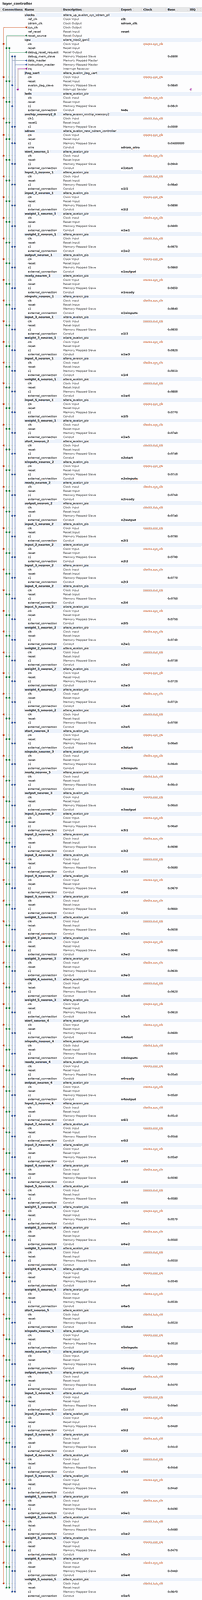
[diagram p0: system contents, whole]
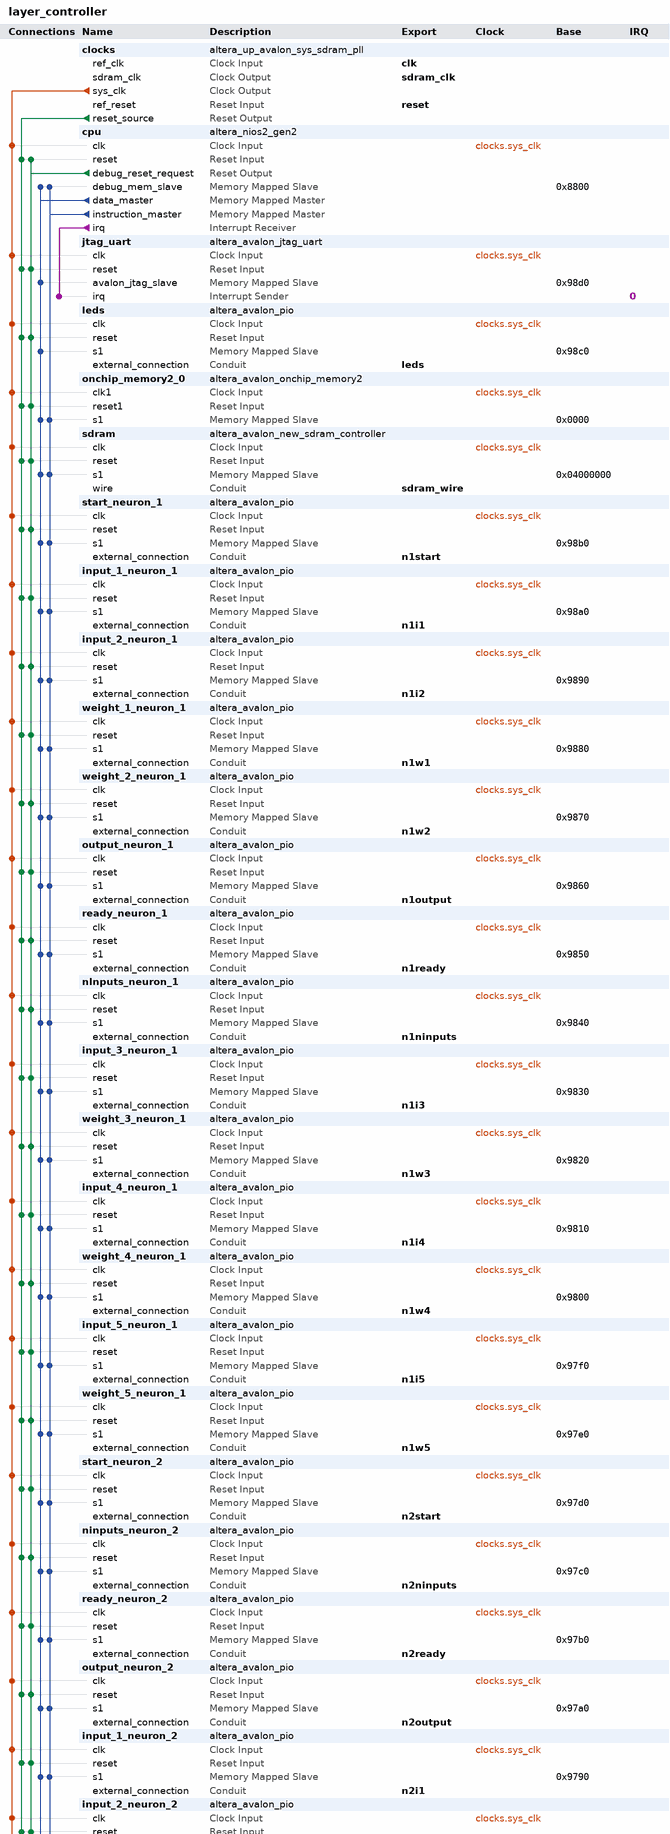
[diagram p1: system contents, upper part]
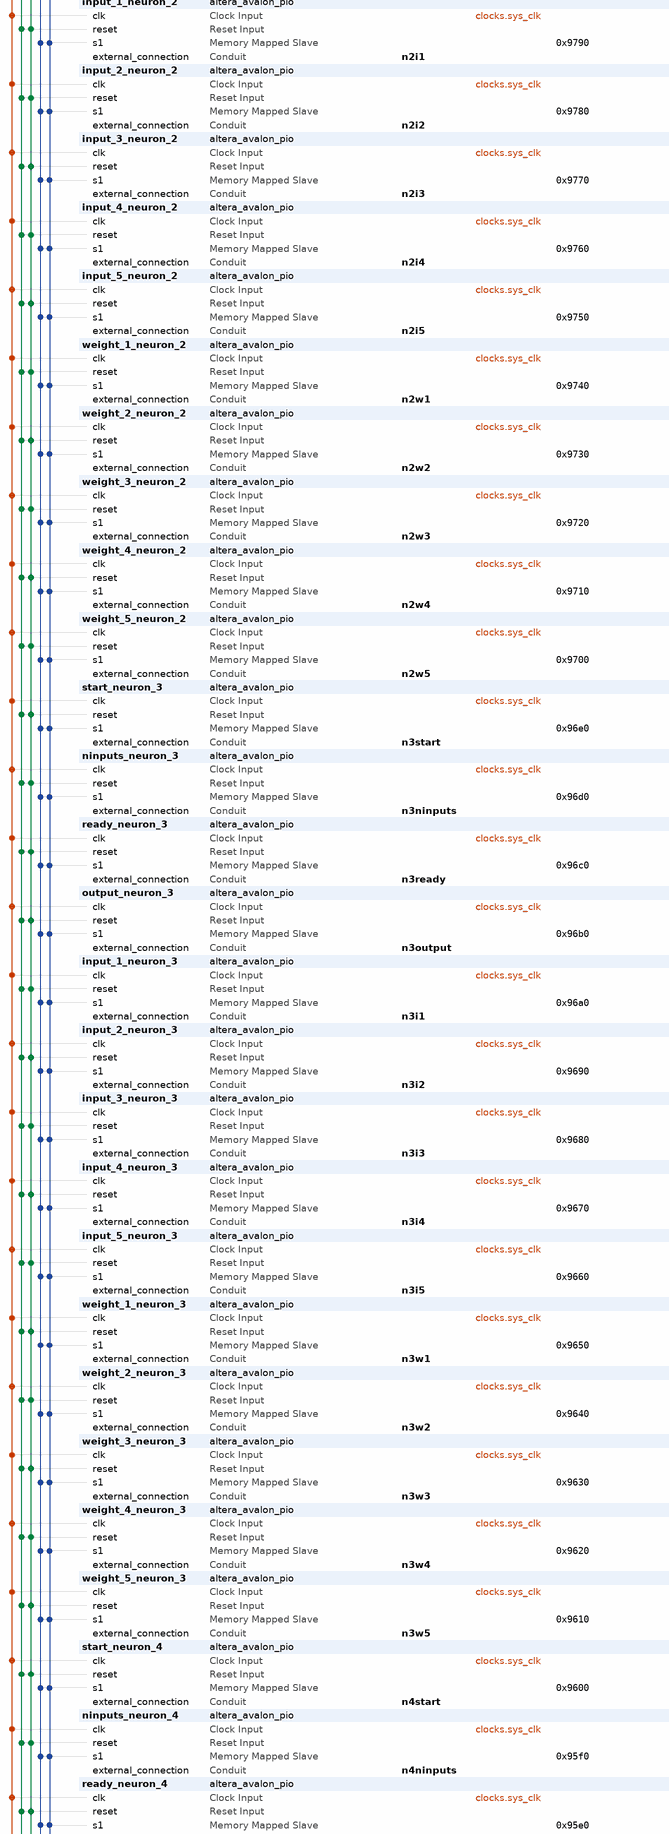
[diagram p2: system contents, middle part]
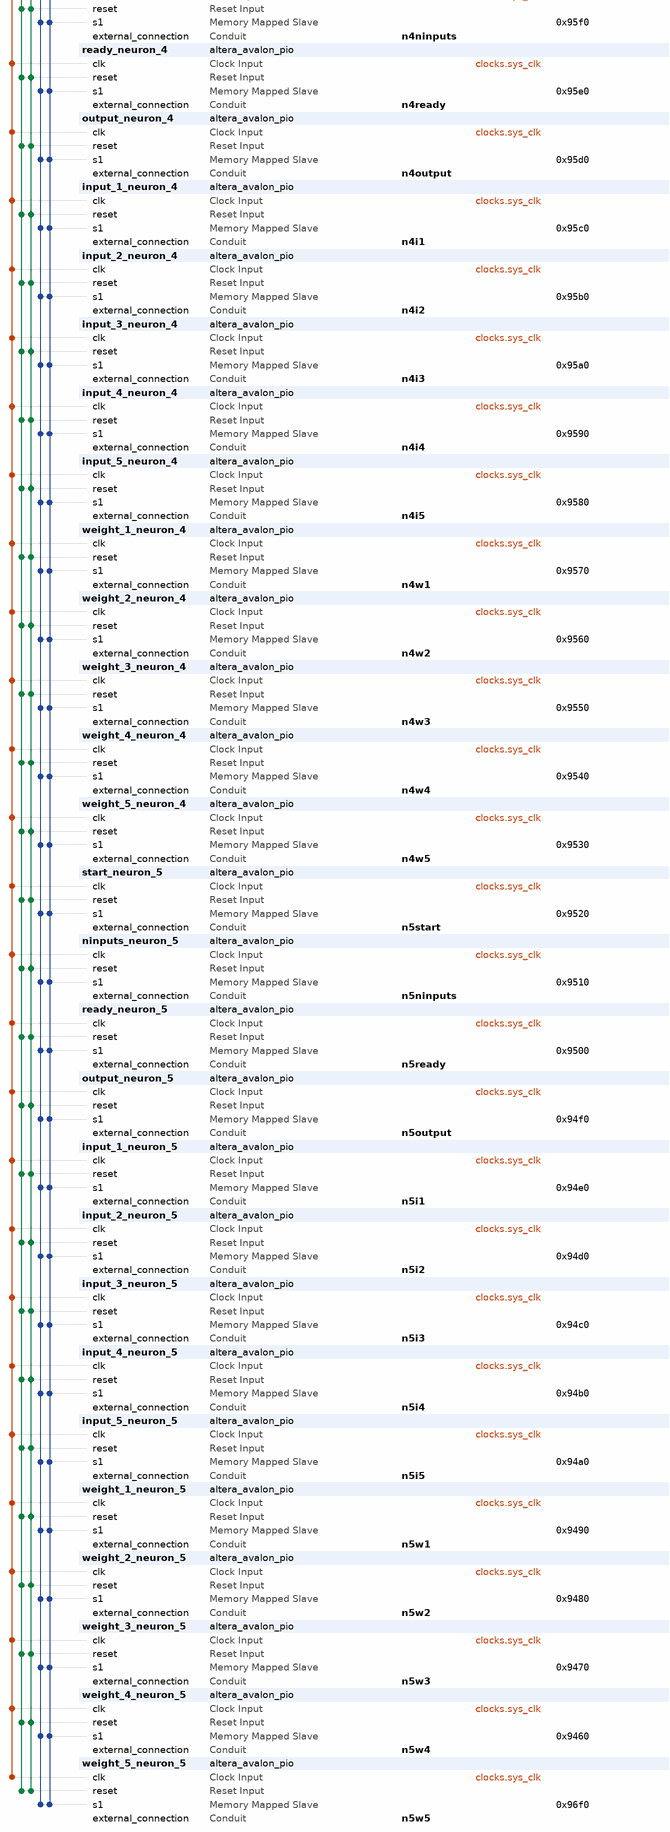
[diagram p3: system contents, lower part]
# Platform Designer (Qsys) system layer_controller, Cyclone IV E EP4CE22F17C6
# Parameters at their usual value, and those the tool derives, are not listed.
package require -exact qsys 18.1
create_system layer_controller
set_project_property DEVICE_FAMILY {Cyclone IV E}
set_project_property DEVICE EP4CE22F17C6

add_instance clocks altera_up_avalon_sys_sdram_pll 18.0
set_instance_parameter_value clocks CIV_boards DE0-Nano
set_instance_parameter_value clocks CV_boards DE10-Standard
set_instance_parameter_value clocks gui_outclk 50.0
set_instance_parameter_value clocks gui_refclk 50.0

add_instance cpu altera_nios2_gen2 18.1
set_instance_parameter_value cpu dcache_size 2048
set_instance_parameter_value cpu exceptionSlave sdram.s1
set_instance_parameter_value cpu icache_size 4096
set_instance_parameter_value cpu impl Tiny
set_instance_parameter_value cpu resetSlave sdram.s1

add_instance jtag_uart altera_avalon_jtag_uart 18.1
set_instance_parameter_value jtag_uart simInteractiveOptions NO_INTERACTIVE_WINDOWS

add_instance leds altera_avalon_pio 18.1
set_instance_parameter_value leds direction Output
set_instance_parameter_value leds width 8

add_instance onchip_memory2_0 altera_avalon_onchip_memory2 18.1
set_instance_parameter_value onchip_memory2_0 dataWidth 32
set_instance_parameter_value onchip_memory2_0 dualPort false
set_instance_parameter_value onchip_memory2_0 initMemContent true
set_instance_parameter_value onchip_memory2_0 initializationFileName onchip_mem.hex
set_instance_parameter_value onchip_memory2_0 memorySize 26000

add_instance sdram altera_avalon_new_sdram_controller 18.1
set_instance_parameter_value sdram TAC 5.5
set_instance_parameter_value sdram TRCD 20.0
set_instance_parameter_value sdram TRP 20.0
set_instance_parameter_value sdram casLatency 3
set_instance_parameter_value sdram columnWidth 9
set_instance_parameter_value sdram dataWidth 16
set_instance_parameter_value sdram generateSimulationModel false
set_instance_parameter_value sdram model single_Micron_MT48LC4M32B2_7_chip
set_instance_parameter_value sdram numberOfBanks 4
set_instance_parameter_value sdram numberOfChipSelects 1
set_instance_parameter_value sdram powerUpDelay 100.0
set_instance_parameter_value sdram refreshPeriod 15.625
set_instance_parameter_value sdram rowWidth 13

add_instance start_neuron_1 altera_avalon_pio 18.1
set_instance_parameter_value start_neuron_1 direction Output
set_instance_parameter_value start_neuron_1 width 1

add_instance input_1_neuron_1 altera_avalon_pio 18.1
set_instance_parameter_value input_1_neuron_1 direction Output
set_instance_parameter_value input_1_neuron_1 width 9

add_instance input_2_neuron_1 altera_avalon_pio 18.1
set_instance_parameter_value input_2_neuron_1 direction Output
set_instance_parameter_value input_2_neuron_1 width 9

add_instance weight_1_neuron_1 altera_avalon_pio 18.1
set_instance_parameter_value weight_1_neuron_1 direction Output
set_instance_parameter_value weight_1_neuron_1 width 17

add_instance weight_2_neuron_1 altera_avalon_pio 18.1
set_instance_parameter_value weight_2_neuron_1 direction Output
set_instance_parameter_value weight_2_neuron_1 width 17

add_instance output_neuron_1 altera_avalon_pio 18.1
set_instance_parameter_value output_neuron_1 direction Input
set_instance_parameter_value output_neuron_1 width 9

add_instance ready_neuron_1 altera_avalon_pio 18.1
set_instance_parameter_value ready_neuron_1 direction Input
set_instance_parameter_value ready_neuron_1 width 1

add_instance nInputs_neuron_1 altera_avalon_pio 18.1
set_instance_parameter_value nInputs_neuron_1 direction Output
set_instance_parameter_value nInputs_neuron_1 width 3

add_instance input_3_neuron_1 altera_avalon_pio 18.1
set_instance_parameter_value input_3_neuron_1 direction Output
set_instance_parameter_value input_3_neuron_1 width 9

add_instance weight_3_neuron_1 altera_avalon_pio 18.1
set_instance_parameter_value weight_3_neuron_1 direction Output
set_instance_parameter_value weight_3_neuron_1 width 17

add_instance input_4_neuron_1 altera_avalon_pio 18.1
set_instance_parameter_value input_4_neuron_1 direction Output
set_instance_parameter_value input_4_neuron_1 width 9

add_instance weight_4_neuron_1 altera_avalon_pio 18.1
set_instance_parameter_value weight_4_neuron_1 direction Output
set_instance_parameter_value weight_4_neuron_1 width 17

add_instance input_5_neuron_1 altera_avalon_pio 18.1
set_instance_parameter_value input_5_neuron_1 direction Output
set_instance_parameter_value input_5_neuron_1 width 9

add_instance weight_5_neuron_1 altera_avalon_pio 18.1
set_instance_parameter_value weight_5_neuron_1 direction Output
set_instance_parameter_value weight_5_neuron_1 width 17

add_instance start_neuron_2 altera_avalon_pio 18.1
set_instance_parameter_value start_neuron_2 direction Output
set_instance_parameter_value start_neuron_2 width 1

add_instance ninputs_neuron_2 altera_avalon_pio 18.1
set_instance_parameter_value ninputs_neuron_2 direction Output
set_instance_parameter_value ninputs_neuron_2 width 3

add_instance ready_neuron_2 altera_avalon_pio 18.1
set_instance_parameter_value ready_neuron_2 direction Input
set_instance_parameter_value ready_neuron_2 width 1

add_instance output_neuron_2 altera_avalon_pio 18.1
set_instance_parameter_value output_neuron_2 direction Input
set_instance_parameter_value output_neuron_2 width 9

add_instance input_1_neuron_2 altera_avalon_pio 18.1
set_instance_parameter_value input_1_neuron_2 direction Output
set_instance_parameter_value input_1_neuron_2 width 9

add_instance input_2_neuron_2 altera_avalon_pio 18.1
set_instance_parameter_value input_2_neuron_2 direction Output
set_instance_parameter_value input_2_neuron_2 width 9

add_instance input_3_neuron_2 altera_avalon_pio 18.1
set_instance_parameter_value input_3_neuron_2 direction Output
set_instance_parameter_value input_3_neuron_2 width 9

add_instance input_4_neuron_2 altera_avalon_pio 18.1
set_instance_parameter_value input_4_neuron_2 direction Output
set_instance_parameter_value input_4_neuron_2 width 9

add_instance input_5_neuron_2 altera_avalon_pio 18.1
set_instance_parameter_value input_5_neuron_2 direction Output
set_instance_parameter_value input_5_neuron_2 width 9

add_instance weight_1_neuron_2 altera_avalon_pio 18.1
set_instance_parameter_value weight_1_neuron_2 direction Output
set_instance_parameter_value weight_1_neuron_2 width 17

add_instance weight_2_neuron_2 altera_avalon_pio 18.1
set_instance_parameter_value weight_2_neuron_2 direction Output
set_instance_parameter_value weight_2_neuron_2 width 17

add_instance weight_3_neuron_2 altera_avalon_pio 18.1
set_instance_parameter_value weight_3_neuron_2 direction Output
set_instance_parameter_value weight_3_neuron_2 width 17

add_instance weight_4_neuron_2 altera_avalon_pio 18.1
set_instance_parameter_value weight_4_neuron_2 direction Output
set_instance_parameter_value weight_4_neuron_2 width 17

add_instance weight_5_neuron_2 altera_avalon_pio 18.1
set_instance_parameter_value weight_5_neuron_2 direction Output
set_instance_parameter_value weight_5_neuron_2 width 17

add_instance start_neuron_3 altera_avalon_pio 18.1
set_instance_parameter_value start_neuron_3 direction Output
set_instance_parameter_value start_neuron_3 width 1

add_instance ninputs_neuron_3 altera_avalon_pio 18.1
set_instance_parameter_value ninputs_neuron_3 direction Output
set_instance_parameter_value ninputs_neuron_3 width 3

add_instance ready_neuron_3 altera_avalon_pio 18.1
set_instance_parameter_value ready_neuron_3 direction Input
set_instance_parameter_value ready_neuron_3 width 1

add_instance output_neuron_3 altera_avalon_pio 18.1
set_instance_parameter_value output_neuron_3 direction Input
set_instance_parameter_value output_neuron_3 width 9

add_instance input_1_neuron_3 altera_avalon_pio 18.1
set_instance_parameter_value input_1_neuron_3 direction Output
set_instance_parameter_value input_1_neuron_3 width 9

add_instance input_2_neuron_3 altera_avalon_pio 18.1
set_instance_parameter_value input_2_neuron_3 direction Output
set_instance_parameter_value input_2_neuron_3 width 9

add_instance input_3_neuron_3 altera_avalon_pio 18.1
set_instance_parameter_value input_3_neuron_3 direction Output
set_instance_parameter_value input_3_neuron_3 width 9

add_instance input_4_neuron_3 altera_avalon_pio 18.1
set_instance_parameter_value input_4_neuron_3 direction Output
set_instance_parameter_value input_4_neuron_3 width 9

add_instance input_5_neuron_3 altera_avalon_pio 18.1
set_instance_parameter_value input_5_neuron_3 direction Output
set_instance_parameter_value input_5_neuron_3 width 9

add_instance weight_1_neuron_3 altera_avalon_pio 18.1
set_instance_parameter_value weight_1_neuron_3 direction Output
set_instance_parameter_value weight_1_neuron_3 width 17

add_instance weight_2_neuron_3 altera_avalon_pio 18.1
set_instance_parameter_value weight_2_neuron_3 direction Output
set_instance_parameter_value weight_2_neuron_3 width 17

add_instance weight_3_neuron_3 altera_avalon_pio 18.1
set_instance_parameter_value weight_3_neuron_3 direction Output
set_instance_parameter_value weight_3_neuron_3 width 17

add_instance weight_4_neuron_3 altera_avalon_pio 18.1
set_instance_parameter_value weight_4_neuron_3 direction Output
set_instance_parameter_value weight_4_neuron_3 width 17

add_instance weight_5_neuron_3 altera_avalon_pio 18.1
set_instance_parameter_value weight_5_neuron_3 direction Output
set_instance_parameter_value weight_5_neuron_3 width 17

add_instance start_neuron_4 altera_avalon_pio 18.1
set_instance_parameter_value start_neuron_4 direction Output
set_instance_parameter_value start_neuron_4 width 1

add_instance ninputs_neuron_4 altera_avalon_pio 18.1
set_instance_parameter_value ninputs_neuron_4 direction Output
set_instance_parameter_value ninputs_neuron_4 width 3

add_instance ready_neuron_4 altera_avalon_pio 18.1
set_instance_parameter_value ready_neuron_4 direction Input
set_instance_parameter_value ready_neuron_4 width 1

add_instance output_neuron_4 altera_avalon_pio 18.1
set_instance_parameter_value output_neuron_4 direction Input
set_instance_parameter_value output_neuron_4 width 9

add_instance input_1_neuron_4 altera_avalon_pio 18.1
set_instance_parameter_value input_1_neuron_4 direction Output
set_instance_parameter_value input_1_neuron_4 width 9

add_instance input_2_neuron_4 altera_avalon_pio 18.1
set_instance_parameter_value input_2_neuron_4 direction Output
set_instance_parameter_value input_2_neuron_4 width 9

add_instance input_3_neuron_4 altera_avalon_pio 18.1
set_instance_parameter_value input_3_neuron_4 direction Output
set_instance_parameter_value input_3_neuron_4 width 9

add_instance input_4_neuron_4 altera_avalon_pio 18.1
set_instance_parameter_value input_4_neuron_4 direction Output
set_instance_parameter_value input_4_neuron_4 width 9

add_instance input_5_neuron_4 altera_avalon_pio 18.1
set_instance_parameter_value input_5_neuron_4 direction Output
set_instance_parameter_value input_5_neuron_4 width 9

add_instance weight_1_neuron_4 altera_avalon_pio 18.1
set_instance_parameter_value weight_1_neuron_4 direction Output
set_instance_parameter_value weight_1_neuron_4 width 17

add_instance weight_2_neuron_4 altera_avalon_pio 18.1
set_instance_parameter_value weight_2_neuron_4 direction Output
set_instance_parameter_value weight_2_neuron_4 width 17

add_instance weight_3_neuron_4 altera_avalon_pio 18.1
set_instance_parameter_value weight_3_neuron_4 direction Output
set_instance_parameter_value weight_3_neuron_4 width 17

add_instance weight_4_neuron_4 altera_avalon_pio 18.1
set_instance_parameter_value weight_4_neuron_4 direction Output
set_instance_parameter_value weight_4_neuron_4 width 17

add_instance weight_5_neuron_4 altera_avalon_pio 18.1
set_instance_parameter_value weight_5_neuron_4 direction Output
set_instance_parameter_value weight_5_neuron_4 width 17

add_instance start_neuron_5 altera_avalon_pio 18.1
set_instance_parameter_value start_neuron_5 direction Output
set_instance_parameter_value start_neuron_5 width 1

add_instance ninputs_neuron_5 altera_avalon_pio 18.1
set_instance_parameter_value ninputs_neuron_5 direction Output
set_instance_parameter_value ninputs_neuron_5 width 3

add_instance ready_neuron_5 altera_avalon_pio 18.1
set_instance_parameter_value ready_neuron_5 direction Input
set_instance_parameter_value ready_neuron_5 width 1

add_instance output_neuron_5 altera_avalon_pio 18.1
set_instance_parameter_value output_neuron_5 direction Input
set_instance_parameter_value output_neuron_5 width 9

add_instance input_1_neuron_5 altera_avalon_pio 18.1
set_instance_parameter_value input_1_neuron_5 direction Output
set_instance_parameter_value input_1_neuron_5 width 9

add_instance input_2_neuron_5 altera_avalon_pio 18.1
set_instance_parameter_value input_2_neuron_5 direction Output
set_instance_parameter_value input_2_neuron_5 width 9

add_instance input_3_neuron_5 altera_avalon_pio 18.1
set_instance_parameter_value input_3_neuron_5 direction Output
set_instance_parameter_value input_3_neuron_5 width 9

add_instance input_4_neuron_5 altera_avalon_pio 18.1
set_instance_parameter_value input_4_neuron_5 direction Output
set_instance_parameter_value input_4_neuron_5 width 9

add_instance input_5_neuron_5 altera_avalon_pio 18.1
set_instance_parameter_value input_5_neuron_5 direction Output
set_instance_parameter_value input_5_neuron_5 width 9

add_instance weight_1_neuron_5 altera_avalon_pio 18.1
set_instance_parameter_value weight_1_neuron_5 direction Output
set_instance_parameter_value weight_1_neuron_5 width 17

add_instance weight_2_neuron_5 altera_avalon_pio 18.1
set_instance_parameter_value weight_2_neuron_5 direction Output
set_instance_parameter_value weight_2_neuron_5 width 17

add_instance weight_3_neuron_5 altera_avalon_pio 18.1
set_instance_parameter_value weight_3_neuron_5 direction Output
set_instance_parameter_value weight_3_neuron_5 width 17

add_instance weight_4_neuron_5 altera_avalon_pio 18.1
set_instance_parameter_value weight_4_neuron_5 direction Output
set_instance_parameter_value weight_4_neuron_5 width 17

add_instance weight_5_neuron_5 altera_avalon_pio 18.1
set_instance_parameter_value weight_5_neuron_5 direction Output
set_instance_parameter_value weight_5_neuron_5 width 17

# connections
add_connection clocks.sys_clk cpu.clk clock
add_connection clocks.sys_clk input_1_neuron_1.clk clock
add_connection clocks.sys_clk input_1_neuron_2.clk clock
add_connection clocks.sys_clk input_1_neuron_3.clk clock
add_connection clocks.sys_clk input_1_neuron_4.clk clock
add_connection clocks.sys_clk input_1_neuron_5.clk clock
add_connection clocks.sys_clk input_2_neuron_1.clk clock
add_connection clocks.sys_clk input_2_neuron_2.clk clock
add_connection clocks.sys_clk input_2_neuron_3.clk clock
add_connection clocks.sys_clk input_2_neuron_4.clk clock
add_connection clocks.sys_clk input_2_neuron_5.clk clock
add_connection clocks.sys_clk input_3_neuron_1.clk clock
add_connection clocks.sys_clk input_3_neuron_2.clk clock
add_connection clocks.sys_clk input_3_neuron_3.clk clock
add_connection clocks.sys_clk input_3_neuron_4.clk clock
add_connection clocks.sys_clk input_3_neuron_5.clk clock
add_connection clocks.sys_clk input_4_neuron_1.clk clock
add_connection clocks.sys_clk input_4_neuron_2.clk clock
add_connection clocks.sys_clk input_4_neuron_3.clk clock
add_connection clocks.sys_clk input_4_neuron_4.clk clock
add_connection clocks.sys_clk input_4_neuron_5.clk clock
add_connection clocks.sys_clk input_5_neuron_1.clk clock
add_connection clocks.sys_clk input_5_neuron_2.clk clock
add_connection clocks.sys_clk input_5_neuron_3.clk clock
add_connection clocks.sys_clk input_5_neuron_4.clk clock
add_connection clocks.sys_clk input_5_neuron_5.clk clock
add_connection clocks.sys_clk jtag_uart.clk clock
add_connection clocks.sys_clk leds.clk clock
add_connection clocks.sys_clk nInputs_neuron_1.clk clock
add_connection clocks.sys_clk ninputs_neuron_2.clk clock
add_connection clocks.sys_clk ninputs_neuron_3.clk clock
add_connection clocks.sys_clk ninputs_neuron_4.clk clock
add_connection clocks.sys_clk ninputs_neuron_5.clk clock
add_connection clocks.sys_clk onchip_memory2_0.clk1 clock
add_connection clocks.sys_clk output_neuron_1.clk clock
add_connection clocks.sys_clk output_neuron_2.clk clock
add_connection clocks.sys_clk output_neuron_3.clk clock
add_connection clocks.sys_clk output_neuron_4.clk clock
add_connection clocks.sys_clk output_neuron_5.clk clock
add_connection clocks.sys_clk ready_neuron_1.clk clock
add_connection clocks.sys_clk ready_neuron_2.clk clock
add_connection clocks.sys_clk ready_neuron_3.clk clock
add_connection clocks.sys_clk ready_neuron_4.clk clock
add_connection clocks.sys_clk ready_neuron_5.clk clock
add_connection clocks.sys_clk sdram.clk clock
add_connection clocks.sys_clk start_neuron_1.clk clock
add_connection clocks.sys_clk start_neuron_2.clk clock
add_connection clocks.sys_clk start_neuron_3.clk clock
add_connection clocks.sys_clk start_neuron_4.clk clock
add_connection clocks.sys_clk start_neuron_5.clk clock
add_connection clocks.sys_clk weight_1_neuron_1.clk clock
add_connection clocks.sys_clk weight_1_neuron_2.clk clock
add_connection clocks.sys_clk weight_1_neuron_3.clk clock
add_connection clocks.sys_clk weight_1_neuron_4.clk clock
add_connection clocks.sys_clk weight_1_neuron_5.clk clock
add_connection clocks.sys_clk weight_2_neuron_1.clk clock
add_connection clocks.sys_clk weight_2_neuron_2.clk clock
add_connection clocks.sys_clk weight_2_neuron_3.clk clock
add_connection clocks.sys_clk weight_2_neuron_4.clk clock
add_connection clocks.sys_clk weight_2_neuron_5.clk clock
add_connection clocks.sys_clk weight_3_neuron_1.clk clock
add_connection clocks.sys_clk weight_3_neuron_2.clk clock
add_connection clocks.sys_clk weight_3_neuron_3.clk clock
add_connection clocks.sys_clk weight_3_neuron_4.clk clock
add_connection clocks.sys_clk weight_3_neuron_5.clk clock
add_connection clocks.sys_clk weight_4_neuron_1.clk clock
add_connection clocks.sys_clk weight_4_neuron_2.clk clock
add_connection clocks.sys_clk weight_4_neuron_3.clk clock
add_connection clocks.sys_clk weight_4_neuron_4.clk clock
add_connection clocks.sys_clk weight_4_neuron_5.clk clock
add_connection clocks.sys_clk weight_5_neuron_1.clk clock
add_connection clocks.sys_clk weight_5_neuron_2.clk clock
add_connection clocks.sys_clk weight_5_neuron_3.clk clock
add_connection clocks.sys_clk weight_5_neuron_4.clk clock
add_connection clocks.sys_clk weight_5_neuron_5.clk clock
add_connection clocks.reset_source cpu.reset reset
add_connection clocks.reset_source input_1_neuron_1.reset reset
add_connection clocks.reset_source input_1_neuron_2.reset reset
add_connection clocks.reset_source input_1_neuron_3.reset reset
add_connection clocks.reset_source input_1_neuron_4.reset reset
add_connection clocks.reset_source input_1_neuron_5.reset reset
add_connection clocks.reset_source input_2_neuron_1.reset reset
add_connection clocks.reset_source input_2_neuron_2.reset reset
add_connection clocks.reset_source input_2_neuron_3.reset reset
add_connection clocks.reset_source input_2_neuron_4.reset reset
add_connection clocks.reset_source input_2_neuron_5.reset reset
add_connection clocks.reset_source input_3_neuron_1.reset reset
add_connection clocks.reset_source input_3_neuron_2.reset reset
add_connection clocks.reset_source input_3_neuron_3.reset reset
add_connection clocks.reset_source input_3_neuron_4.reset reset
add_connection clocks.reset_source input_3_neuron_5.reset reset
add_connection clocks.reset_source input_4_neuron_1.reset reset
add_connection clocks.reset_source input_4_neuron_2.reset reset
add_connection clocks.reset_source input_4_neuron_3.reset reset
add_connection clocks.reset_source input_4_neuron_4.reset reset
add_connection clocks.reset_source input_4_neuron_5.reset reset
add_connection clocks.reset_source input_5_neuron_1.reset reset
add_connection clocks.reset_source input_5_neuron_2.reset reset
add_connection clocks.reset_source input_5_neuron_3.reset reset
add_connection clocks.reset_source input_5_neuron_4.reset reset
add_connection clocks.reset_source input_5_neuron_5.reset reset
add_connection clocks.reset_source jtag_uart.reset reset
add_connection clocks.reset_source leds.reset reset
add_connection clocks.reset_source nInputs_neuron_1.reset reset
add_connection clocks.reset_source ninputs_neuron_2.reset reset
add_connection clocks.reset_source ninputs_neuron_3.reset reset
add_connection clocks.reset_source ninputs_neuron_4.reset reset
add_connection clocks.reset_source ninputs_neuron_5.reset reset
add_connection clocks.reset_source onchip_memory2_0.reset1 reset
add_connection clocks.reset_source output_neuron_1.reset reset
add_connection clocks.reset_source output_neuron_2.reset reset
add_connection clocks.reset_source output_neuron_3.reset reset
add_connection clocks.reset_source output_neuron_4.reset reset
add_connection clocks.reset_source output_neuron_5.reset reset
add_connection clocks.reset_source ready_neuron_1.reset reset
add_connection clocks.reset_source ready_neuron_2.reset reset
add_connection clocks.reset_source ready_neuron_3.reset reset
add_connection clocks.reset_source ready_neuron_4.reset reset
add_connection clocks.reset_source ready_neuron_5.reset reset
add_connection clocks.reset_source sdram.reset reset
add_connection clocks.reset_source start_neuron_1.reset reset
add_connection clocks.reset_source start_neuron_2.reset reset
add_connection clocks.reset_source start_neuron_3.reset reset
add_connection clocks.reset_source start_neuron_4.reset reset
add_connection clocks.reset_source start_neuron_5.reset reset
add_connection clocks.reset_source weight_1_neuron_1.reset reset
add_connection clocks.reset_source weight_1_neuron_2.reset reset
add_connection clocks.reset_source weight_1_neuron_3.reset reset
add_connection clocks.reset_source weight_1_neuron_4.reset reset
add_connection clocks.reset_source weight_1_neuron_5.reset reset
add_connection clocks.reset_source weight_2_neuron_1.reset reset
add_connection clocks.reset_source weight_2_neuron_2.reset reset
add_connection clocks.reset_source weight_2_neuron_3.reset reset
add_connection clocks.reset_source weight_2_neuron_4.reset reset
add_connection clocks.reset_source weight_2_neuron_5.reset reset
add_connection clocks.reset_source weight_3_neuron_1.reset reset
add_connection clocks.reset_source weight_3_neuron_2.reset reset
add_connection clocks.reset_source weight_3_neuron_3.reset reset
add_connection clocks.reset_source weight_3_neuron_4.reset reset
add_connection clocks.reset_source weight_3_neuron_5.reset reset
add_connection clocks.reset_source weight_4_neuron_1.reset reset
add_connection clocks.reset_source weight_4_neuron_2.reset reset
add_connection clocks.reset_source weight_4_neuron_3.reset reset
add_connection clocks.reset_source weight_4_neuron_4.reset reset
add_connection clocks.reset_source weight_4_neuron_5.reset reset
add_connection clocks.reset_source weight_5_neuron_1.reset reset
add_connection clocks.reset_source weight_5_neuron_2.reset reset
add_connection clocks.reset_source weight_5_neuron_3.reset reset
add_connection clocks.reset_source weight_5_neuron_4.reset reset
add_connection clocks.reset_source weight_5_neuron_5.reset reset
add_connection cpu.debug_reset_request cpu.reset reset
add_connection cpu.debug_reset_request input_1_neuron_1.reset reset
add_connection cpu.debug_reset_request input_1_neuron_2.reset reset
add_connection cpu.debug_reset_request input_1_neuron_3.reset reset
add_connection cpu.debug_reset_request input_1_neuron_4.reset reset
add_connection cpu.debug_reset_request input_1_neuron_5.reset reset
add_connection cpu.debug_reset_request input_2_neuron_1.reset reset
add_connection cpu.debug_reset_request input_2_neuron_2.reset reset
add_connection cpu.debug_reset_request input_2_neuron_3.reset reset
add_connection cpu.debug_reset_request input_2_neuron_4.reset reset
add_connection cpu.debug_reset_request input_2_neuron_5.reset reset
add_connection cpu.debug_reset_request input_3_neuron_1.reset reset
add_connection cpu.debug_reset_request input_3_neuron_2.reset reset
add_connection cpu.debug_reset_request input_3_neuron_3.reset reset
add_connection cpu.debug_reset_request input_3_neuron_4.reset reset
add_connection cpu.debug_reset_request input_3_neuron_5.reset reset
add_connection cpu.debug_reset_request input_4_neuron_1.reset reset
add_connection cpu.debug_reset_request input_4_neuron_2.reset reset
add_connection cpu.debug_reset_request input_4_neuron_3.reset reset
add_connection cpu.debug_reset_request input_4_neuron_4.reset reset
add_connection cpu.debug_reset_request input_4_neuron_5.reset reset
add_connection cpu.debug_reset_request input_5_neuron_1.reset reset
add_connection cpu.debug_reset_request input_5_neuron_2.reset reset
add_connection cpu.debug_reset_request input_5_neuron_3.reset reset
add_connection cpu.debug_reset_request input_5_neuron_4.reset reset
add_connection cpu.debug_reset_request input_5_neuron_5.reset reset
add_connection cpu.debug_reset_request jtag_uart.reset reset
add_connection cpu.debug_reset_request leds.reset reset
add_connection cpu.debug_reset_request nInputs_neuron_1.reset reset
add_connection cpu.debug_reset_request ninputs_neuron_2.reset reset
add_connection cpu.debug_reset_request ninputs_neuron_3.reset reset
add_connection cpu.debug_reset_request ninputs_neuron_4.reset reset
add_connection cpu.debug_reset_request ninputs_neuron_5.reset reset
add_connection cpu.debug_reset_request onchip_memory2_0.reset1 reset
add_connection cpu.debug_reset_request output_neuron_1.reset reset
add_connection cpu.debug_reset_request output_neuron_2.reset reset
add_connection cpu.debug_reset_request output_neuron_3.reset reset
add_connection cpu.debug_reset_request output_neuron_4.reset reset
add_connection cpu.debug_reset_request output_neuron_5.reset reset
add_connection cpu.debug_reset_request ready_neuron_1.reset reset
add_connection cpu.debug_reset_request ready_neuron_2.reset reset
add_connection cpu.debug_reset_request ready_neuron_3.reset reset
add_connection cpu.debug_reset_request ready_neuron_4.reset reset
add_connection cpu.debug_reset_request ready_neuron_5.reset reset
add_connection cpu.debug_reset_request sdram.reset reset
add_connection cpu.debug_reset_request start_neuron_1.reset reset
add_connection cpu.debug_reset_request start_neuron_2.reset reset
add_connection cpu.debug_reset_request start_neuron_3.reset reset
add_connection cpu.debug_reset_request start_neuron_4.reset reset
add_connection cpu.debug_reset_request start_neuron_5.reset reset
add_connection cpu.debug_reset_request weight_1_neuron_1.reset reset
add_connection cpu.debug_reset_request weight_1_neuron_2.reset reset
add_connection cpu.debug_reset_request weight_1_neuron_3.reset reset
add_connection cpu.debug_reset_request weight_1_neuron_4.reset reset
add_connection cpu.debug_reset_request weight_1_neuron_5.reset reset
add_connection cpu.debug_reset_request weight_2_neuron_1.reset reset
add_connection cpu.debug_reset_request weight_2_neuron_2.reset reset
add_connection cpu.debug_reset_request weight_2_neuron_3.reset reset
add_connection cpu.debug_reset_request weight_2_neuron_4.reset reset
add_connection cpu.debug_reset_request weight_2_neuron_5.reset reset
add_connection cpu.debug_reset_request weight_3_neuron_1.reset reset
add_connection cpu.debug_reset_request weight_3_neuron_2.reset reset
add_connection cpu.debug_reset_request weight_3_neuron_3.reset reset
add_connection cpu.debug_reset_request weight_3_neuron_4.reset reset
add_connection cpu.debug_reset_request weight_3_neuron_5.reset reset
add_connection cpu.debug_reset_request weight_4_neuron_1.reset reset
add_connection cpu.debug_reset_request weight_4_neuron_2.reset reset
add_connection cpu.debug_reset_request weight_4_neuron_3.reset reset
add_connection cpu.debug_reset_request weight_4_neuron_4.reset reset
add_connection cpu.debug_reset_request weight_4_neuron_5.reset reset
add_connection cpu.debug_reset_request weight_5_neuron_1.reset reset
add_connection cpu.debug_reset_request weight_5_neuron_2.reset reset
add_connection cpu.debug_reset_request weight_5_neuron_3.reset reset
add_connection cpu.debug_reset_request weight_5_neuron_4.reset reset
add_connection cpu.debug_reset_request weight_5_neuron_5.reset reset
add_connection cpu.data_master cpu.debug_mem_slave avalon
set_connection_parameter_value cpu.data_master/cpu.debug_mem_slave baseAddress 0x8800
add_connection cpu.data_master input_1_neuron_1.s1 avalon
set_connection_parameter_value cpu.data_master/input_1_neuron_1.s1 baseAddress 0x98a0
add_connection cpu.data_master input_1_neuron_2.s1 avalon
set_connection_parameter_value cpu.data_master/input_1_neuron_2.s1 baseAddress 0x9790
add_connection cpu.data_master input_1_neuron_3.s1 avalon
set_connection_parameter_value cpu.data_master/input_1_neuron_3.s1 baseAddress 0x96a0
add_connection cpu.data_master input_1_neuron_4.s1 avalon
set_connection_parameter_value cpu.data_master/input_1_neuron_4.s1 baseAddress 0x95c0
add_connection cpu.data_master input_1_neuron_5.s1 avalon
set_connection_parameter_value cpu.data_master/input_1_neuron_5.s1 baseAddress 0x94e0
add_connection cpu.data_master input_2_neuron_1.s1 avalon
set_connection_parameter_value cpu.data_master/input_2_neuron_1.s1 baseAddress 0x9890
add_connection cpu.data_master input_2_neuron_2.s1 avalon
set_connection_parameter_value cpu.data_master/input_2_neuron_2.s1 baseAddress 0x9780
add_connection cpu.data_master input_2_neuron_3.s1 avalon
set_connection_parameter_value cpu.data_master/input_2_neuron_3.s1 baseAddress 0x9690
add_connection cpu.data_master input_2_neuron_4.s1 avalon
set_connection_parameter_value cpu.data_master/input_2_neuron_4.s1 baseAddress 0x95b0
add_connection cpu.data_master input_2_neuron_5.s1 avalon
set_connection_parameter_value cpu.data_master/input_2_neuron_5.s1 baseAddress 0x94d0
add_connection cpu.data_master input_3_neuron_1.s1 avalon
set_connection_parameter_value cpu.data_master/input_3_neuron_1.s1 baseAddress 0x9830
add_connection cpu.data_master input_3_neuron_2.s1 avalon
set_connection_parameter_value cpu.data_master/input_3_neuron_2.s1 baseAddress 0x9770
add_connection cpu.data_master input_3_neuron_3.s1 avalon
set_connection_parameter_value cpu.data_master/input_3_neuron_3.s1 baseAddress 0x9680
add_connection cpu.data_master input_3_neuron_4.s1 avalon
set_connection_parameter_value cpu.data_master/input_3_neuron_4.s1 baseAddress 0x95a0
add_connection cpu.data_master input_3_neuron_5.s1 avalon
set_connection_parameter_value cpu.data_master/input_3_neuron_5.s1 baseAddress 0x94c0
add_connection cpu.data_master input_4_neuron_1.s1 avalon
set_connection_parameter_value cpu.data_master/input_4_neuron_1.s1 baseAddress 0x9810
add_connection cpu.data_master input_4_neuron_2.s1 avalon
set_connection_parameter_value cpu.data_master/input_4_neuron_2.s1 baseAddress 0x9760
add_connection cpu.data_master input_4_neuron_3.s1 avalon
set_connection_parameter_value cpu.data_master/input_4_neuron_3.s1 baseAddress 0x9670
add_connection cpu.data_master input_4_neuron_4.s1 avalon
set_connection_parameter_value cpu.data_master/input_4_neuron_4.s1 baseAddress 0x9590
add_connection cpu.data_master input_4_neuron_5.s1 avalon
set_connection_parameter_value cpu.data_master/input_4_neuron_5.s1 baseAddress 0x94b0
add_connection cpu.data_master input_5_neuron_1.s1 avalon
set_connection_parameter_value cpu.data_master/input_5_neuron_1.s1 baseAddress 0x97f0
add_connection cpu.data_master input_5_neuron_2.s1 avalon
set_connection_parameter_value cpu.data_master/input_5_neuron_2.s1 baseAddress 0x9750
add_connection cpu.data_master input_5_neuron_3.s1 avalon
set_connection_parameter_value cpu.data_master/input_5_neuron_3.s1 baseAddress 0x9660
add_connection cpu.data_master input_5_neuron_4.s1 avalon
set_connection_parameter_value cpu.data_master/input_5_neuron_4.s1 baseAddress 0x9580
add_connection cpu.data_master input_5_neuron_5.s1 avalon
set_connection_parameter_value cpu.data_master/input_5_neuron_5.s1 baseAddress 0x94a0
add_connection cpu.data_master jtag_uart.avalon_jtag_slave avalon
set_connection_parameter_value cpu.data_master/jtag_uart.avalon_jtag_slave baseAddress 0x98d0
add_connection cpu.data_master leds.s1 avalon
set_connection_parameter_value cpu.data_master/leds.s1 baseAddress 0x98c0
add_connection cpu.data_master nInputs_neuron_1.s1 avalon
set_connection_parameter_value cpu.data_master/nInputs_neuron_1.s1 baseAddress 0x9840
add_connection cpu.data_master ninputs_neuron_2.s1 avalon
set_connection_parameter_value cpu.data_master/ninputs_neuron_2.s1 baseAddress 0x97c0
add_connection cpu.data_master ninputs_neuron_3.s1 avalon
set_connection_parameter_value cpu.data_master/ninputs_neuron_3.s1 baseAddress 0x96d0
add_connection cpu.data_master ninputs_neuron_4.s1 avalon
set_connection_parameter_value cpu.data_master/ninputs_neuron_4.s1 baseAddress 0x95f0
add_connection cpu.data_master ninputs_neuron_5.s1 avalon
set_connection_parameter_value cpu.data_master/ninputs_neuron_5.s1 baseAddress 0x9510
add_connection cpu.data_master onchip_memory2_0.s1 avalon
set_connection_parameter_value cpu.data_master/onchip_memory2_0.s1 baseAddress 0x0000
add_connection cpu.data_master output_neuron_1.s1 avalon
set_connection_parameter_value cpu.data_master/output_neuron_1.s1 baseAddress 0x9860
add_connection cpu.data_master output_neuron_2.s1 avalon
set_connection_parameter_value cpu.data_master/output_neuron_2.s1 baseAddress 0x97a0
add_connection cpu.data_master output_neuron_3.s1 avalon
set_connection_parameter_value cpu.data_master/output_neuron_3.s1 baseAddress 0x96b0
add_connection cpu.data_master output_neuron_4.s1 avalon
set_connection_parameter_value cpu.data_master/output_neuron_4.s1 baseAddress 0x95d0
add_connection cpu.data_master output_neuron_5.s1 avalon
set_connection_parameter_value cpu.data_master/output_neuron_5.s1 baseAddress 0x94f0
add_connection cpu.data_master ready_neuron_1.s1 avalon
set_connection_parameter_value cpu.data_master/ready_neuron_1.s1 baseAddress 0x9850
add_connection cpu.data_master ready_neuron_2.s1 avalon
set_connection_parameter_value cpu.data_master/ready_neuron_2.s1 baseAddress 0x97b0
add_connection cpu.data_master ready_neuron_3.s1 avalon
set_connection_parameter_value cpu.data_master/ready_neuron_3.s1 baseAddress 0x96c0
add_connection cpu.data_master ready_neuron_4.s1 avalon
set_connection_parameter_value cpu.data_master/ready_neuron_4.s1 baseAddress 0x95e0
add_connection cpu.data_master ready_neuron_5.s1 avalon
set_connection_parameter_value cpu.data_master/ready_neuron_5.s1 baseAddress 0x9500
add_connection cpu.data_master sdram.s1 avalon
set_connection_parameter_value cpu.data_master/sdram.s1 baseAddress 0x04000000
add_connection cpu.data_master start_neuron_1.s1 avalon
set_connection_parameter_value cpu.data_master/start_neuron_1.s1 baseAddress 0x98b0
add_connection cpu.data_master start_neuron_2.s1 avalon
set_connection_parameter_value cpu.data_master/start_neuron_2.s1 baseAddress 0x97d0
add_connection cpu.data_master start_neuron_3.s1 avalon
set_connection_parameter_value cpu.data_master/start_neuron_3.s1 baseAddress 0x96e0
add_connection cpu.data_master start_neuron_4.s1 avalon
set_connection_parameter_value cpu.data_master/start_neuron_4.s1 baseAddress 0x9600
add_connection cpu.data_master start_neuron_5.s1 avalon
set_connection_parameter_value cpu.data_master/start_neuron_5.s1 baseAddress 0x9520
add_connection cpu.data_master weight_1_neuron_1.s1 avalon
set_connection_parameter_value cpu.data_master/weight_1_neuron_1.s1 baseAddress 0x9880
add_connection cpu.data_master weight_1_neuron_2.s1 avalon
set_connection_parameter_value cpu.data_master/weight_1_neuron_2.s1 baseAddress 0x9740
add_connection cpu.data_master weight_1_neuron_3.s1 avalon
set_connection_parameter_value cpu.data_master/weight_1_neuron_3.s1 baseAddress 0x9650
add_connection cpu.data_master weight_1_neuron_4.s1 avalon
set_connection_parameter_value cpu.data_master/weight_1_neuron_4.s1 baseAddress 0x9570
add_connection cpu.data_master weight_1_neuron_5.s1 avalon
set_connection_parameter_value cpu.data_master/weight_1_neuron_5.s1 baseAddress 0x9490
add_connection cpu.data_master weight_2_neuron_1.s1 avalon
set_connection_parameter_value cpu.data_master/weight_2_neuron_1.s1 baseAddress 0x9870
add_connection cpu.data_master weight_2_neuron_2.s1 avalon
set_connection_parameter_value cpu.data_master/weight_2_neuron_2.s1 baseAddress 0x9730
add_connection cpu.data_master weight_2_neuron_3.s1 avalon
set_connection_parameter_value cpu.data_master/weight_2_neuron_3.s1 baseAddress 0x9640
add_connection cpu.data_master weight_2_neuron_4.s1 avalon
set_connection_parameter_value cpu.data_master/weight_2_neuron_4.s1 baseAddress 0x9560
add_connection cpu.data_master weight_2_neuron_5.s1 avalon
set_connection_parameter_value cpu.data_master/weight_2_neuron_5.s1 baseAddress 0x9480
add_connection cpu.data_master weight_3_neuron_1.s1 avalon
set_connection_parameter_value cpu.data_master/weight_3_neuron_1.s1 baseAddress 0x9820
add_connection cpu.data_master weight_3_neuron_2.s1 avalon
set_connection_parameter_value cpu.data_master/weight_3_neuron_2.s1 baseAddress 0x9720
add_connection cpu.data_master weight_3_neuron_3.s1 avalon
set_connection_parameter_value cpu.data_master/weight_3_neuron_3.s1 baseAddress 0x9630
add_connection cpu.data_master weight_3_neuron_4.s1 avalon
set_connection_parameter_value cpu.data_master/weight_3_neuron_4.s1 baseAddress 0x9550
add_connection cpu.data_master weight_3_neuron_5.s1 avalon
set_connection_parameter_value cpu.data_master/weight_3_neuron_5.s1 baseAddress 0x9470
add_connection cpu.data_master weight_4_neuron_1.s1 avalon
set_connection_parameter_value cpu.data_master/weight_4_neuron_1.s1 baseAddress 0x9800
add_connection cpu.data_master weight_4_neuron_2.s1 avalon
set_connection_parameter_value cpu.data_master/weight_4_neuron_2.s1 baseAddress 0x9710
add_connection cpu.data_master weight_4_neuron_3.s1 avalon
set_connection_parameter_value cpu.data_master/weight_4_neuron_3.s1 baseAddress 0x9620
add_connection cpu.data_master weight_4_neuron_4.s1 avalon
set_connection_parameter_value cpu.data_master/weight_4_neuron_4.s1 baseAddress 0x9540
add_connection cpu.data_master weight_4_neuron_5.s1 avalon
set_connection_parameter_value cpu.data_master/weight_4_neuron_5.s1 baseAddress 0x9460
add_connection cpu.data_master weight_5_neuron_1.s1 avalon
set_connection_parameter_value cpu.data_master/weight_5_neuron_1.s1 baseAddress 0x97e0
add_connection cpu.data_master weight_5_neuron_2.s1 avalon
set_connection_parameter_value cpu.data_master/weight_5_neuron_2.s1 baseAddress 0x9700
add_connection cpu.data_master weight_5_neuron_3.s1 avalon
set_connection_parameter_value cpu.data_master/weight_5_neuron_3.s1 baseAddress 0x9610
add_connection cpu.data_master weight_5_neuron_4.s1 avalon
set_connection_parameter_value cpu.data_master/weight_5_neuron_4.s1 baseAddress 0x9530
add_connection cpu.data_master weight_5_neuron_5.s1 avalon
set_connection_parameter_value cpu.data_master/weight_5_neuron_5.s1 baseAddress 0x96f0
add_connection cpu.instruction_master cpu.debug_mem_slave avalon
set_connection_parameter_value cpu.instruction_master/cpu.debug_mem_slave baseAddress 0x8800
add_connection cpu.instruction_master input_1_neuron_1.s1 avalon
set_connection_parameter_value cpu.instruction_master/input_1_neuron_1.s1 baseAddress 0x98a0
add_connection cpu.instruction_master input_1_neuron_2.s1 avalon
set_connection_parameter_value cpu.instruction_master/input_1_neuron_2.s1 baseAddress 0x9790
add_connection cpu.instruction_master input_1_neuron_3.s1 avalon
set_connection_parameter_value cpu.instruction_master/input_1_neuron_3.s1 baseAddress 0x96a0
add_connection cpu.instruction_master input_1_neuron_4.s1 avalon
set_connection_parameter_value cpu.instruction_master/input_1_neuron_4.s1 baseAddress 0x95c0
add_connection cpu.instruction_master input_1_neuron_5.s1 avalon
set_connection_parameter_value cpu.instruction_master/input_1_neuron_5.s1 baseAddress 0x94e0
add_connection cpu.instruction_master input_2_neuron_1.s1 avalon
set_connection_parameter_value cpu.instruction_master/input_2_neuron_1.s1 baseAddress 0x9890
add_connection cpu.instruction_master input_2_neuron_2.s1 avalon
set_connection_parameter_value cpu.instruction_master/input_2_neuron_2.s1 baseAddress 0x9780
add_connection cpu.instruction_master input_2_neuron_3.s1 avalon
set_connection_parameter_value cpu.instruction_master/input_2_neuron_3.s1 baseAddress 0x9690
add_connection cpu.instruction_master input_2_neuron_4.s1 avalon
set_connection_parameter_value cpu.instruction_master/input_2_neuron_4.s1 baseAddress 0x95b0
add_connection cpu.instruction_master input_2_neuron_5.s1 avalon
set_connection_parameter_value cpu.instruction_master/input_2_neuron_5.s1 baseAddress 0x94d0
add_connection cpu.instruction_master input_3_neuron_1.s1 avalon
set_connection_parameter_value cpu.instruction_master/input_3_neuron_1.s1 baseAddress 0x9830
add_connection cpu.instruction_master input_3_neuron_2.s1 avalon
set_connection_parameter_value cpu.instruction_master/input_3_neuron_2.s1 baseAddress 0x9770
add_connection cpu.instruction_master input_3_neuron_3.s1 avalon
set_connection_parameter_value cpu.instruction_master/input_3_neuron_3.s1 baseAddress 0x9680
add_connection cpu.instruction_master input_3_neuron_4.s1 avalon
set_connection_parameter_value cpu.instruction_master/input_3_neuron_4.s1 baseAddress 0x95a0
add_connection cpu.instruction_master input_3_neuron_5.s1 avalon
set_connection_parameter_value cpu.instruction_master/input_3_neuron_5.s1 baseAddress 0x94c0
add_connection cpu.instruction_master input_4_neuron_1.s1 avalon
set_connection_parameter_value cpu.instruction_master/input_4_neuron_1.s1 baseAddress 0x9810
add_connection cpu.instruction_master input_4_neuron_2.s1 avalon
set_connection_parameter_value cpu.instruction_master/input_4_neuron_2.s1 baseAddress 0x9760
add_connection cpu.instruction_master input_4_neuron_3.s1 avalon
set_connection_parameter_value cpu.instruction_master/input_4_neuron_3.s1 baseAddress 0x9670
add_connection cpu.instruction_master input_4_neuron_4.s1 avalon
set_connection_parameter_value cpu.instruction_master/input_4_neuron_4.s1 baseAddress 0x9590
add_connection cpu.instruction_master input_4_neuron_5.s1 avalon
set_connection_parameter_value cpu.instruction_master/input_4_neuron_5.s1 baseAddress 0x94b0
add_connection cpu.instruction_master input_5_neuron_1.s1 avalon
set_connection_parameter_value cpu.instruction_master/input_5_neuron_1.s1 baseAddress 0x97f0
add_connection cpu.instruction_master input_5_neuron_2.s1 avalon
set_connection_parameter_value cpu.instruction_master/input_5_neuron_2.s1 baseAddress 0x9750
add_connection cpu.instruction_master input_5_neuron_3.s1 avalon
set_connection_parameter_value cpu.instruction_master/input_5_neuron_3.s1 baseAddress 0x9660
add_connection cpu.instruction_master input_5_neuron_4.s1 avalon
set_connection_parameter_value cpu.instruction_master/input_5_neuron_4.s1 baseAddress 0x9580
add_connection cpu.instruction_master input_5_neuron_5.s1 avalon
set_connection_parameter_value cpu.instruction_master/input_5_neuron_5.s1 baseAddress 0x94a0
add_connection cpu.instruction_master nInputs_neuron_1.s1 avalon
set_connection_parameter_value cpu.instruction_master/nInputs_neuron_1.s1 baseAddress 0x9840
add_connection cpu.instruction_master ninputs_neuron_2.s1 avalon
set_connection_parameter_value cpu.instruction_master/ninputs_neuron_2.s1 baseAddress 0x97c0
add_connection cpu.instruction_master ninputs_neuron_3.s1 avalon
set_connection_parameter_value cpu.instruction_master/ninputs_neuron_3.s1 baseAddress 0x96d0
add_connection cpu.instruction_master ninputs_neuron_4.s1 avalon
set_connection_parameter_value cpu.instruction_master/ninputs_neuron_4.s1 baseAddress 0x95f0
add_connection cpu.instruction_master ninputs_neuron_5.s1 avalon
set_connection_parameter_value cpu.instruction_master/ninputs_neuron_5.s1 baseAddress 0x9510
add_connection cpu.instruction_master onchip_memory2_0.s1 avalon
set_connection_parameter_value cpu.instruction_master/onchip_memory2_0.s1 baseAddress 0x0000
add_connection cpu.instruction_master output_neuron_1.s1 avalon
set_connection_parameter_value cpu.instruction_master/output_neuron_1.s1 baseAddress 0x9860
add_connection cpu.instruction_master output_neuron_2.s1 avalon
set_connection_parameter_value cpu.instruction_master/output_neuron_2.s1 baseAddress 0x97a0
add_connection cpu.instruction_master output_neuron_3.s1 avalon
set_connection_parameter_value cpu.instruction_master/output_neuron_3.s1 baseAddress 0x96b0
add_connection cpu.instruction_master output_neuron_4.s1 avalon
set_connection_parameter_value cpu.instruction_master/output_neuron_4.s1 baseAddress 0x95d0
add_connection cpu.instruction_master output_neuron_5.s1 avalon
set_connection_parameter_value cpu.instruction_master/output_neuron_5.s1 baseAddress 0x94f0
add_connection cpu.instruction_master ready_neuron_1.s1 avalon
set_connection_parameter_value cpu.instruction_master/ready_neuron_1.s1 baseAddress 0x9850
add_connection cpu.instruction_master ready_neuron_2.s1 avalon
set_connection_parameter_value cpu.instruction_master/ready_neuron_2.s1 baseAddress 0x97b0
add_connection cpu.instruction_master ready_neuron_3.s1 avalon
set_connection_parameter_value cpu.instruction_master/ready_neuron_3.s1 baseAddress 0x96c0
add_connection cpu.instruction_master ready_neuron_4.s1 avalon
set_connection_parameter_value cpu.instruction_master/ready_neuron_4.s1 baseAddress 0x95e0
add_connection cpu.instruction_master ready_neuron_5.s1 avalon
set_connection_parameter_value cpu.instruction_master/ready_neuron_5.s1 baseAddress 0x9500
add_connection cpu.instruction_master sdram.s1 avalon
set_connection_parameter_value cpu.instruction_master/sdram.s1 baseAddress 0x04000000
add_connection cpu.instruction_master start_neuron_1.s1 avalon
set_connection_parameter_value cpu.instruction_master/start_neuron_1.s1 baseAddress 0x98b0
add_connection cpu.instruction_master start_neuron_2.s1 avalon
set_connection_parameter_value cpu.instruction_master/start_neuron_2.s1 baseAddress 0x97d0
add_connection cpu.instruction_master start_neuron_3.s1 avalon
set_connection_parameter_value cpu.instruction_master/start_neuron_3.s1 baseAddress 0x96e0
add_connection cpu.instruction_master start_neuron_4.s1 avalon
set_connection_parameter_value cpu.instruction_master/start_neuron_4.s1 baseAddress 0x9600
add_connection cpu.instruction_master start_neuron_5.s1 avalon
set_connection_parameter_value cpu.instruction_master/start_neuron_5.s1 baseAddress 0x9520
add_connection cpu.instruction_master weight_1_neuron_1.s1 avalon
set_connection_parameter_value cpu.instruction_master/weight_1_neuron_1.s1 baseAddress 0x9880
add_connection cpu.instruction_master weight_1_neuron_2.s1 avalon
set_connection_parameter_value cpu.instruction_master/weight_1_neuron_2.s1 baseAddress 0x9740
add_connection cpu.instruction_master weight_1_neuron_3.s1 avalon
set_connection_parameter_value cpu.instruction_master/weight_1_neuron_3.s1 baseAddress 0x9650
add_connection cpu.instruction_master weight_1_neuron_4.s1 avalon
set_connection_parameter_value cpu.instruction_master/weight_1_neuron_4.s1 baseAddress 0x9570
add_connection cpu.instruction_master weight_1_neuron_5.s1 avalon
set_connection_parameter_value cpu.instruction_master/weight_1_neuron_5.s1 baseAddress 0x9490
add_connection cpu.instruction_master weight_2_neuron_1.s1 avalon
set_connection_parameter_value cpu.instruction_master/weight_2_neuron_1.s1 baseAddress 0x9870
add_connection cpu.instruction_master weight_2_neuron_2.s1 avalon
set_connection_parameter_value cpu.instruction_master/weight_2_neuron_2.s1 baseAddress 0x9730
add_connection cpu.instruction_master weight_2_neuron_3.s1 avalon
set_connection_parameter_value cpu.instruction_master/weight_2_neuron_3.s1 baseAddress 0x9640
add_connection cpu.instruction_master weight_2_neuron_4.s1 avalon
set_connection_parameter_value cpu.instruction_master/weight_2_neuron_4.s1 baseAddress 0x9560
add_connection cpu.instruction_master weight_2_neuron_5.s1 avalon
set_connection_parameter_value cpu.instruction_master/weight_2_neuron_5.s1 baseAddress 0x9480
add_connection cpu.instruction_master weight_3_neuron_1.s1 avalon
set_connection_parameter_value cpu.instruction_master/weight_3_neuron_1.s1 baseAddress 0x9820
add_connection cpu.instruction_master weight_3_neuron_2.s1 avalon
set_connection_parameter_value cpu.instruction_master/weight_3_neuron_2.s1 baseAddress 0x9720
add_connection cpu.instruction_master weight_3_neuron_3.s1 avalon
set_connection_parameter_value cpu.instruction_master/weight_3_neuron_3.s1 baseAddress 0x9630
add_connection cpu.instruction_master weight_3_neuron_4.s1 avalon
set_connection_parameter_value cpu.instruction_master/weight_3_neuron_4.s1 baseAddress 0x9550
add_connection cpu.instruction_master weight_3_neuron_5.s1 avalon
set_connection_parameter_value cpu.instruction_master/weight_3_neuron_5.s1 baseAddress 0x9470
add_connection cpu.instruction_master weight_4_neuron_1.s1 avalon
set_connection_parameter_value cpu.instruction_master/weight_4_neuron_1.s1 baseAddress 0x9800
add_connection cpu.instruction_master weight_4_neuron_2.s1 avalon
set_connection_parameter_value cpu.instruction_master/weight_4_neuron_2.s1 baseAddress 0x9710
add_connection cpu.instruction_master weight_4_neuron_3.s1 avalon
set_connection_parameter_value cpu.instruction_master/weight_4_neuron_3.s1 baseAddress 0x9620
